# Altium schematic sheet io-bus2.SchDoc: GECKO3 System and I/O Bus
size A4; Organization: Berne University of Applied Science; Address1: School of Engineering and; Address2: Information Technology; Address3: Quellgasse 21; Address4: CH-2501 Biel; Revision: 1.0; SheetNumber: 8; SheetTotal: 19; ApprovedBy: zem1; Author: zac1
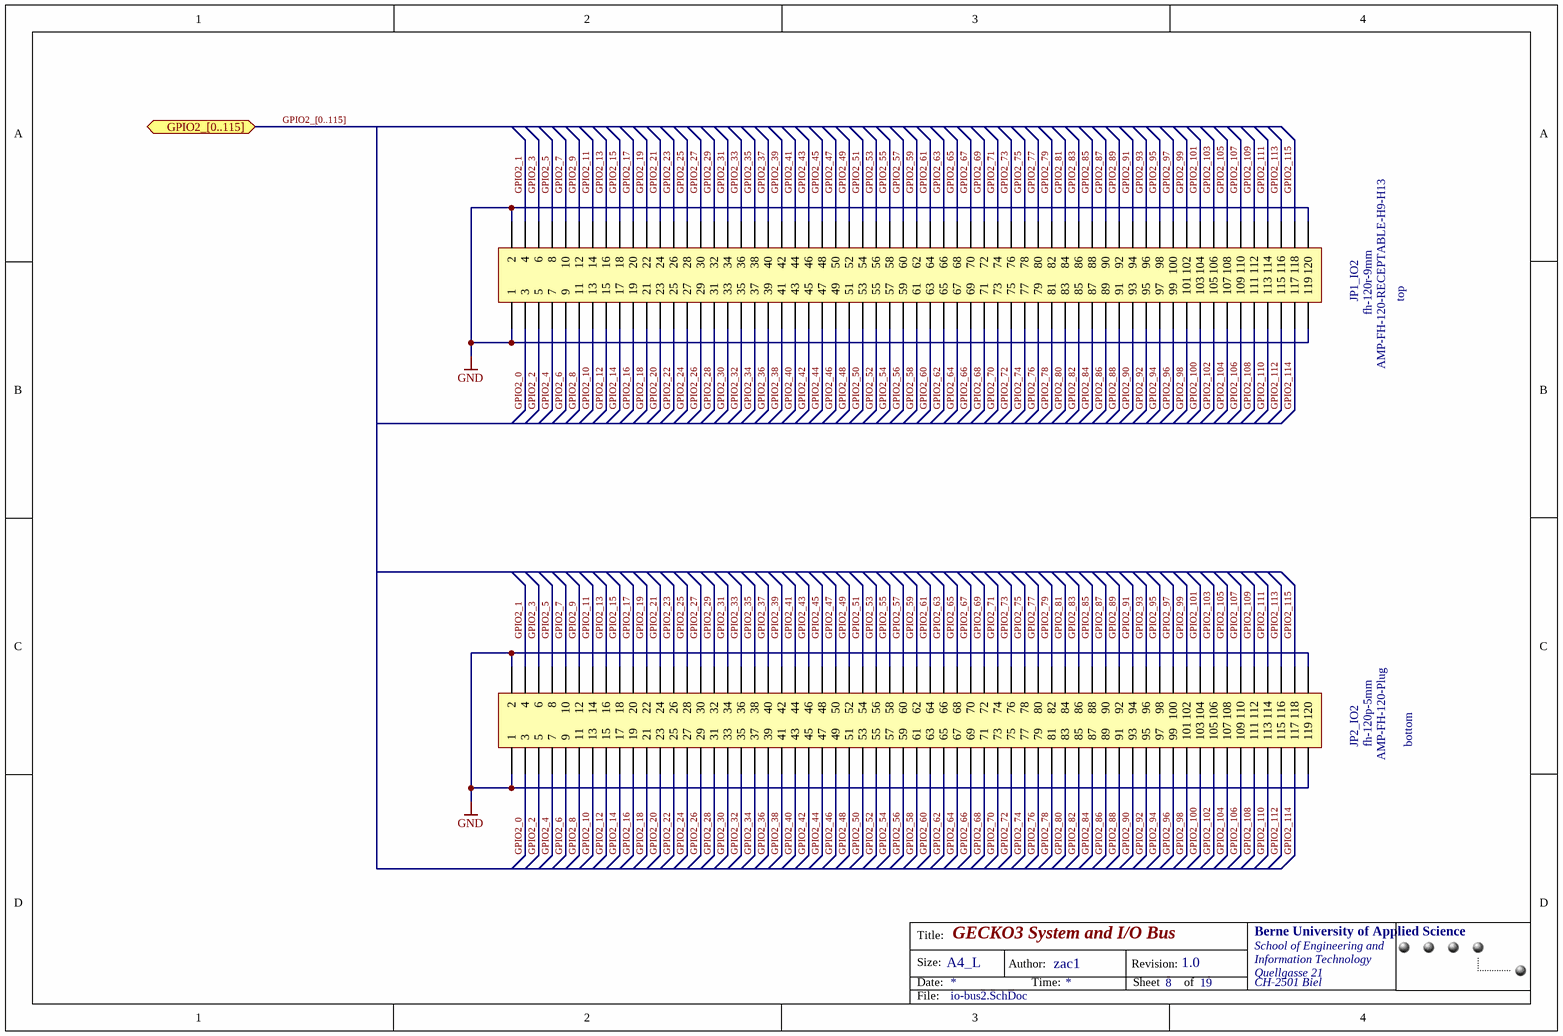
[diagram p0: io-bus2.SchDoc]

## Parts
JP1_IO2  AMP-FH-120-RECEPTABLE-H9-H13  value fh-120r-9mm  Comment_1: top  [amp_FH_.8mm_120pin_r_H9_H13]
JP2_IO2  AMP-FH-120-Plug  value fh-120p-5mm  Comment_1: bottom  [amp_FH_.8mm_120pin_plug]

## Ports
GPIO2_[0..115] (bidir)

## Nets
GND: JP1_IO2.1 JP1_IO2.2 JP1_IO2.119 JP1_IO2.120 JP2_IO2.1 JP2_IO2.2 JP2_IO2.119 JP2_IO2.120
GPIO2_0: JP1_IO2.3 JP2_IO2.3
GPIO2_1: JP1_IO2.4 JP2_IO2.4
GPIO2_2: JP1_IO2.5 JP2_IO2.5
GPIO2_3: JP1_IO2.6 JP2_IO2.6
GPIO2_4: JP1_IO2.7 JP2_IO2.7
GPIO2_5: JP1_IO2.8 JP2_IO2.8
GPIO2_6: JP1_IO2.9 JP2_IO2.9
GPIO2_7: JP1_IO2.10 JP2_IO2.10
GPIO2_8: JP1_IO2.11 JP2_IO2.11
GPIO2_9: JP1_IO2.12 JP2_IO2.12
GPIO2_10: JP1_IO2.13 JP2_IO2.13
GPIO2_11: JP1_IO2.14 JP2_IO2.14
GPIO2_12: JP1_IO2.15 JP2_IO2.15
GPIO2_13: JP1_IO2.16 JP2_IO2.16
GPIO2_14: JP1_IO2.17 JP2_IO2.17
GPIO2_15: JP1_IO2.18 JP2_IO2.18
GPIO2_16: JP1_IO2.19 JP2_IO2.19
GPIO2_17: JP1_IO2.20 JP2_IO2.20
GPIO2_18: JP1_IO2.21 JP2_IO2.21
GPIO2_19: JP1_IO2.22 JP2_IO2.22
GPIO2_20: JP1_IO2.23 JP2_IO2.23
GPIO2_21: JP1_IO2.24 JP2_IO2.24
GPIO2_22: JP1_IO2.25 JP2_IO2.25
GPIO2_23: JP1_IO2.26 JP2_IO2.26
GPIO2_24: JP1_IO2.27 JP2_IO2.27
GPIO2_25: JP1_IO2.28 JP2_IO2.28
GPIO2_26: JP1_IO2.29 JP2_IO2.29
GPIO2_27: JP1_IO2.30 JP2_IO2.30
GPIO2_28: JP1_IO2.31 JP2_IO2.31
GPIO2_29: JP1_IO2.32 JP2_IO2.32
GPIO2_30: JP1_IO2.33 JP2_IO2.33
GPIO2_31: JP1_IO2.34 JP2_IO2.34
GPIO2_32: JP1_IO2.35 JP2_IO2.35
GPIO2_33: JP1_IO2.36 JP2_IO2.36
GPIO2_34: JP1_IO2.37 JP2_IO2.37
GPIO2_35: JP1_IO2.38 JP2_IO2.38
GPIO2_36: JP1_IO2.39 JP2_IO2.39
GPIO2_37: JP1_IO2.40 JP2_IO2.40
GPIO2_38: JP1_IO2.41 JP2_IO2.41
GPIO2_39: JP1_IO2.42 JP2_IO2.42
GPIO2_40: JP1_IO2.43 JP2_IO2.43
GPIO2_41: JP1_IO2.44 JP2_IO2.44
GPIO2_42: JP1_IO2.45 JP2_IO2.45
GPIO2_43: JP1_IO2.46 JP2_IO2.46
GPIO2_44: JP1_IO2.47 JP2_IO2.47
GPIO2_45: JP1_IO2.48 JP2_IO2.48
GPIO2_46: JP1_IO2.49 JP2_IO2.49
GPIO2_47: JP1_IO2.50 JP2_IO2.50
GPIO2_48: JP1_IO2.51 JP2_IO2.51
GPIO2_49: JP1_IO2.52 JP2_IO2.52
GPIO2_50: JP1_IO2.53 JP2_IO2.53
GPIO2_51: JP1_IO2.54 JP2_IO2.54
GPIO2_52: JP1_IO2.55 JP2_IO2.55
GPIO2_53: JP1_IO2.56 JP2_IO2.56
GPIO2_54: JP1_IO2.57 JP2_IO2.57
GPIO2_55: JP1_IO2.58 JP2_IO2.58
GPIO2_56: JP1_IO2.59 JP2_IO2.59
GPIO2_57: JP1_IO2.60 JP2_IO2.60
GPIO2_58: JP1_IO2.61 JP2_IO2.61
GPIO2_59: JP1_IO2.62 JP2_IO2.62
GPIO2_60: JP1_IO2.63 JP2_IO2.63
GPIO2_61: JP1_IO2.64 JP2_IO2.64
GPIO2_62: JP1_IO2.65 JP2_IO2.65
GPIO2_63: JP1_IO2.66 JP2_IO2.66
GPIO2_64: JP1_IO2.67 JP2_IO2.67
GPIO2_65: JP1_IO2.68 JP2_IO2.68
GPIO2_66: JP1_IO2.69 JP2_IO2.69
GPIO2_67: JP1_IO2.70 JP2_IO2.70
GPIO2_68: JP1_IO2.71 JP2_IO2.71
GPIO2_69: JP1_IO2.72 JP2_IO2.72
GPIO2_70: JP1_IO2.73 JP2_IO2.73
GPIO2_71: JP1_IO2.74 JP2_IO2.74
GPIO2_72: JP1_IO2.75 JP2_IO2.75
GPIO2_73: JP1_IO2.76 JP2_IO2.76
GPIO2_74: JP1_IO2.77 JP2_IO2.77
GPIO2_75: JP1_IO2.78 JP2_IO2.78
GPIO2_76: JP1_IO2.79 JP2_IO2.79
GPIO2_77: JP1_IO2.80 JP2_IO2.80
GPIO2_78: JP1_IO2.81 JP2_IO2.81
GPIO2_79: JP1_IO2.82 JP2_IO2.82
GPIO2_80: JP1_IO2.83 JP2_IO2.83
GPIO2_81: JP1_IO2.84 JP2_IO2.84
GPIO2_82: JP1_IO2.85 JP2_IO2.85
GPIO2_83: JP1_IO2.86 JP2_IO2.86
GPIO2_84: JP1_IO2.87 JP2_IO2.87
GPIO2_85: JP1_IO2.88 JP2_IO2.88
GPIO2_86: JP1_IO2.89 JP2_IO2.89
GPIO2_87: JP1_IO2.90 JP2_IO2.90
GPIO2_88: JP1_IO2.91 JP2_IO2.91
GPIO2_89: JP1_IO2.92 JP2_IO2.92
GPIO2_90: JP1_IO2.93 JP2_IO2.93
GPIO2_91: JP1_IO2.94 JP2_IO2.94
GPIO2_92: JP1_IO2.95 JP2_IO2.95
GPIO2_93: JP1_IO2.96 JP2_IO2.96
GPIO2_94: JP1_IO2.97 JP2_IO2.97
GPIO2_95: JP1_IO2.98 JP2_IO2.98
GPIO2_96: JP1_IO2.99 JP2_IO2.99
GPIO2_97: JP1_IO2.100 JP2_IO2.100
GPIO2_98: JP1_IO2.101 JP2_IO2.101
GPIO2_99: JP1_IO2.102 JP2_IO2.102
GPIO2_100: JP1_IO2.103 JP2_IO2.103
GPIO2_101: JP1_IO2.104 JP2_IO2.104
GPIO2_102: JP1_IO2.105 JP2_IO2.105
GPIO2_103: JP1_IO2.106 JP2_IO2.106
GPIO2_104: JP1_IO2.107 JP2_IO2.107
GPIO2_105: JP1_IO2.108 JP2_IO2.108
GPIO2_106: JP1_IO2.109 JP2_IO2.109
GPIO2_107: JP1_IO2.110 JP2_IO2.110
GPIO2_108: JP1_IO2.111 JP2_IO2.111
GPIO2_109: JP1_IO2.112 JP2_IO2.112
GPIO2_110: JP1_IO2.113 JP2_IO2.113
GPIO2_111: JP1_IO2.114 JP2_IO2.114
GPIO2_112: JP1_IO2.115 JP2_IO2.115
GPIO2_113: JP1_IO2.116 JP2_IO2.116
GPIO2_114: JP1_IO2.117 JP2_IO2.117
GPIO2_115: JP1_IO2.118 JP2_IO2.118

## Buses and harness runs
bus GPIO2_[0..115] = port GPIO2_[0..115]

## Notes on the sheet
- Title:
- Size:
- Date:
- A4_L
- Author:
- Time:
- Revision:
- Sheet
- of
- File:

## Library data of the parts
JP1_IO2 = AMP-FH-120-RECEPTABLE-H9-H13: AMP Free Height System, 0.8mm, 120 Pin, 9 or 13mm Height, Receptable; Part Number: 5-5179009-5; Currency: CHF; Packaging unit: 1; Manufacturer: AMP; RoHS: yes; Distributor: Farnell; Distributor Number: 1098 355; Price: 6.85
JP2_IO2 = AMP-FH-120-Plug: AMP Free Height System, 0.8mm, 120 Pin, Plug; Part Number: 5177984-5; Currency: CHF; Packaging unit: 1; Manufacturer: AMP; RoHS: yes; Distributor: Farnell; Distributor Number: 1098 339; Price: 7.95